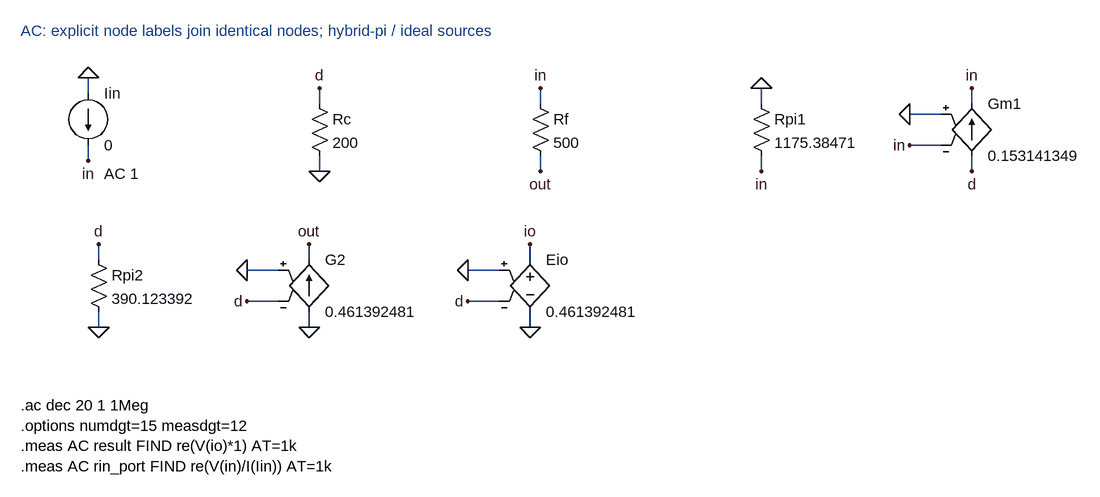
[diagram p0: schematic AC.asc]
AC.asc, the LTspice schematic file:
Version 4
SHEET 1 1800 1500
TEXT 16 -48 Left 2 ;AC: explicit node labels join identical nodes; hybrid-pi / ideal sources
WIRE 120 48 120 24
FLAG 120 24 0
WIRE 120 128 120 152
FLAG 120 152 in
SYMBOL current 120 48 R0
SYMATTR InstName Iin
WINDOW 123 24 124 Left 2
SYMATTR Value 0
SYMATTR Value2 AC 1
WIRE 476 64 476 40
FLAG 476 40 d
WIRE 476 144 476 168
FLAG 476 168 0
SYMBOL res 460 48 R0
SYMATTR InstName Rc
SYMATTR Value 200
WIRE 816 64 816 40
FLAG 816 40 in
WIRE 816 144 816 168
FLAG 816 168 out
SYMBOL res 800 48 R0
SYMATTR InstName Rf
SYMATTR Value 500
WIRE 1156 64 1156 40
FLAG 1156 40 0
WIRE 1156 144 1156 168
FLAG 1156 168 in
SYMBOL res 1140 48 R0
SYMATTR InstName Rpi1
SYMATTR Value 1175.38471
WIRE 1480 144 1480 168
FLAG 1480 168 d
WIRE 1480 64 1480 40
FLAG 1480 40 in
WIRE 1432 80 1384 80
FLAG 1384 80 0
WIRE 1432 128 1384 128
FLAG 1384 128 in
SYMBOL g 1480 48 R0
SYMATTR InstName Gm1
SYMATTR Value 0.153141349
WIRE 136 304 136 280
FLAG 136 280 d
WIRE 136 384 136 408
FLAG 136 408 0
SYMBOL res 120 288 R0
SYMATTR InstName Rpi2
SYMATTR Value 390.123392
WIRE 460 384 460 408
FLAG 460 408 0
WIRE 460 304 460 280
FLAG 460 280 out
WIRE 412 320 364 320
FLAG 364 320 0
WIRE 412 368 364 368
FLAG 364 368 d
SYMBOL g 460 288 R0
SYMATTR InstName G2
SYMATTR Value 0.461392481
WIRE 800 304 800 280
FLAG 800 280 io
WIRE 800 384 800 408
FLAG 800 408 0
WIRE 752 320 704 320
FLAG 704 320 0
WIRE 752 368 704 368
FLAG 704 368 d
SYMBOL e 800 288 R0
SYMATTR InstName Eio
SYMATTR Value 0.461392481
TEXT 16 528 Left 2 !.ac dec 20 1 1Meg\n.options numdgt=15 measdgt=12\n.meas AC result FIND re(V(io)*1) AT=1k\n.meas AC rin_port FIND re(V(in)/I(Iin)) AT=1k

The netlist it stands for:
* AC.asc
Iin 0 in 0 AC 1
Rc d 0 200
Rf in out 500
Rpi1 0 in 1175.38471
Gm1 d in 0 in 0.153141349
Rpi2 d 0 390.123392
G2 0 out 0 d 0.461392481
Eio io 0 0 d 0.461392481
* AC: explicit node labels join identical nodes; hybrid-pi / ideal sources
.ac dec 20 1 1Meg
.options numdgt=15 measdgt=12
.meas AC result FIND re(V(io)*1) AT=1k
.meas AC rin_port FIND re(V(in)/I(Iin)) AT=1k
.backanno
.end

* Results of the author's LTspice run, read from the files saved beside the schematic
* From the log:
*   result: re(V(io)*1)=(-0.142005683919dB,180°) at 1000
*   rin_port: re(V(in)/I(Iin))=(-19.5510484535dB,0°) at 1000